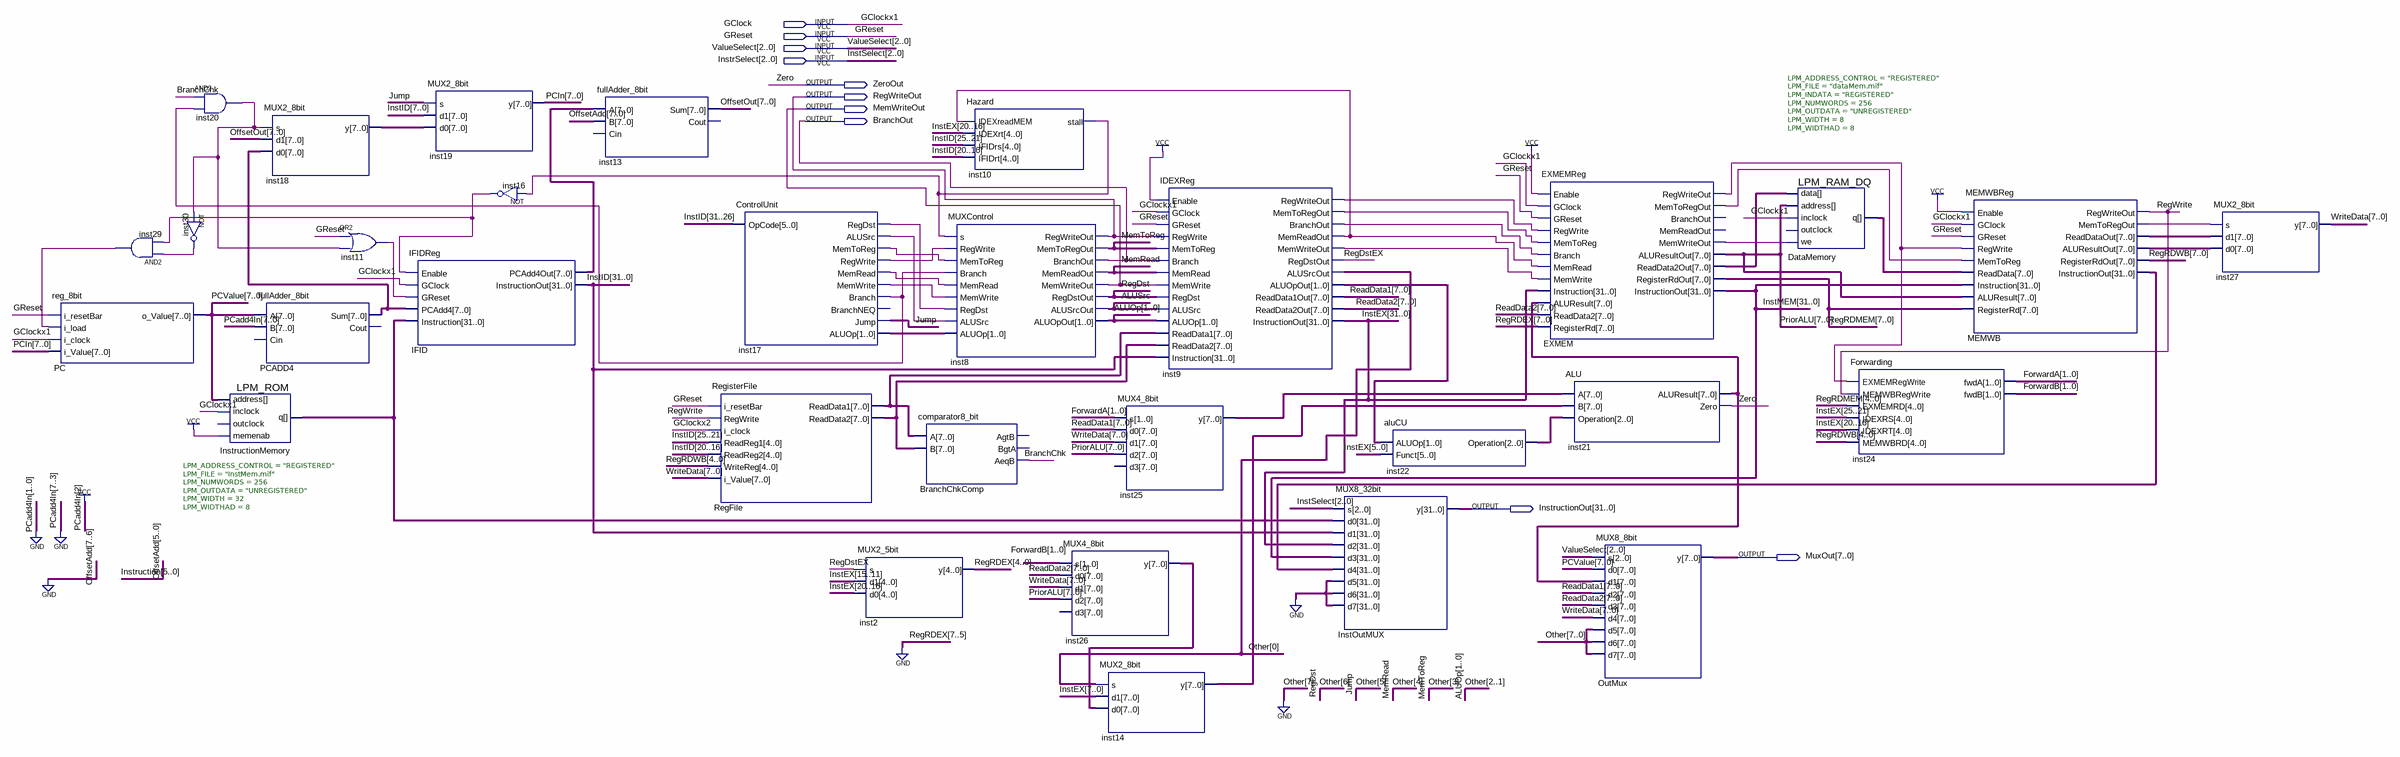
[diagram p0: schematic sheet]
// Quartus schematic pipelineProc.bdf as structural Verilog: 31 symbols, 10 pins
module pipelineProc (
  input  GClock,
  input  GReset,
  input  [2:0] ValueSelect,
  input  [2:0] InstrSelect,
  output ZeroOut,
  output RegWriteOut,
  output MemWriteOut,
  output BranchOut,
  output [31:0] InstructionOut,
  output [7:0] MuxOut
);

  wire ALUSrc, BranchChk, EXMEM_memtoregout, EXMEM_memwriteout, EXMEM_regwriteout, GClockx2, inst9_branchout,
       inst9_memreadout, inst9_memtoregout, inst9_memwriteout, inst9_regwriteout, inst10_stall, inst11_out,
       inst16_out, inst17_alusrc, inst17_branch, inst17_memread, inst17_memtoreg, inst17_memwrite,
       inst17_regdst, inst17_regwrite, inst20_out, inst29_out, inst30_out, Jump, MemRead, MemToReg,
       MEMWB_memtoregout, RegDst, RegDstEX, RegWrite;
  wire [1:0] ALUOp, ForwardA, ForwardB, inst9_aluopout, inst17_aluop;
  wire [2:0] inst22_operation;
  wire [4:0] RegRDEX;
  wire [5:0] OffsetAdd;
  wire [6:0] Other;
  wire [7:0] DataMemory_q, EXMEM_readdata2out, IFID_pcadd4out, inst14_y, inst18_y, inst21_aluresult,
       inst25_y, inst26_y, MEMWB_aluresultout, MEMWB_readdataout, OffsetOut, PCADD4_sum, PCIn, PCValue,
       PriorALU, ReadData1, ReadData2, RegFile_readdata1, RegFile_readdata2, RegRDMEM, RegRDWB, WriteData;
  wire [31:0] InstEX, InstID, InstMEM, InstructionMemory_q, MEMWB_instructionout;

  reg_8bit PC (.i_resetBar(GReset), .i_load(inst29_out), .i_clock(GClock), .i_Value(PCIn), .o_Value(PCValue));
  and inst29 (inst29_out, inst30_out, inst16_out);
  and inst20 (inst20_out, BranchChk, inst17_branch);
  not inst30 (inst30_out, inst20_out);
  LPM_ROM #(.LPM_ADDRESS_CONTROL("REGISTERED"), .LPM_FILE("InstMem.mif"), .LPM_NUMWORDS(256), .LPM_OUTDATA("UNREGISTERED"), .LPM_WIDTH(32), .LPM_WIDTHAD(8)) InstructionMemory (
    .address(PCValue), .inclock(GClock), .memenab(1'b1), .q(InstructionMemory_q));  // open: outclock
  MUX2_8bit inst18 (.s(inst20_out), .d1(OffsetOut), .d0(PCADD4_sum), .y(inst18_y));
  fullAdder_8bit PCADD4 (.A(PCValue), .B(8'b00000100), .Sum(PCADD4_sum));  // open: Cin, Cout
  or inst11 (inst11_out, GReset, inst20_out);
  MUX2_8bit inst19 (.s(Jump), .d1(InstID[7:0]), .d0(inst18_y), .y(PCIn));
  IFIDReg IFID (
    .Enable(inst16_out), .GClock(GClock), .GReset(inst11_out), .PCAdd4(PCADD4_sum),
    .Instruction(InstructionMemory_q), .PCAdd4Out(IFID_pcadd4out), .InstructionOut(InstID));
  not inst16 (inst16_out, inst10_stall);
  fullAdder_8bit inst13 (.A(IFID_pcadd4out), .B({2'b00, OffsetAdd}), .Sum(OffsetOut));  // open: Cin, Cout
  ControlUnit inst17 (
    .OpCode(InstID[31:26]), .RegDst(inst17_regdst), .ALUSrc(inst17_alusrc), .MemToReg(inst17_memtoreg),
    .RegWrite(inst17_regwrite), .MemRead(inst17_memread), .MemWrite(inst17_memwrite), .Branch(inst17_branch),
    .Jump(Jump), .ALUOp(inst17_aluop));  // open: BranchNEQ
  RegisterFile RegFile (
    .i_resetBar(GReset), .RegWrite(RegWrite), .i_clock(GClockx2), .ReadReg1(InstID[25:21]),
    .ReadReg2(InstID[20:16]), .WriteReg(RegRDWB[4:0]), .i_Value(WriteData), .ReadData1(RegFile_readdata1),
    .ReadData2(RegFile_readdata2));
  MUX2_5bit inst2 (.s(RegDstEX), .d1(InstEX[15:11]), .d0(InstEX[20:16]), .y(RegRDEX));
  comparator8_bit BranchChkComp (.A(RegFile_readdata1), .B(RegFile_readdata2), .AeqB(BranchChk));  // open: AgtB, BgtA
  Hazard inst10 (
    .IDEXreadMEM(inst9_memreadout), .IDEXrt(InstEX[20:16]), .IFIDrs(InstID[25:21]), .IFIDrt(InstID[20:16]),
    .stall(inst10_stall));
  MUXControl inst8 (
    .s(inst10_stall), .RegWrite(inst17_regwrite), .MemToReg(inst17_memtoreg), .Branch(inst17_branch),
    .MemRead(inst17_memread), .MemWrite(inst17_memwrite), .RegDst(inst17_regdst), .ALUSrc(inst17_alusrc),
    .ALUOp(inst17_aluop), .RegWriteOut(RegWriteOut), .MemToRegOut(MemToReg), .BranchOut(BranchOut),
    .MemReadOut(MemRead), .MemWriteOut(MemWriteOut), .RegDstOut(RegDst), .ALUSrcOut(ALUSrc), .ALUOpOut(ALUOp));
  MUX4_8bit inst26 (.s(ForwardB), .d0(ReadData2), .d1(WriteData), .d2(PriorALU), .y(inst26_y));  // open: d3
  MUX4_8bit inst25 (.s(ForwardA), .d0(ReadData1), .d1(WriteData), .d2(PriorALU), .y(inst25_y));  // open: d3
  MUX2_8bit inst14 (.s(Other[0]), .d1(InstEX[7:0]), .d0(inst26_y), .y(inst14_y));
  IDEXReg inst9 (
    .Enable(1'b1), .GClock(GClock), .GReset(GReset), .RegWrite(RegWriteOut), .MemToReg(MemToReg),
    .Branch(BranchOut), .MemRead(MemRead), .MemWrite(MemWriteOut), .RegDst(RegDst), .ALUSrc(ALUSrc),
    .ALUOp(ALUOp), .ReadData1(RegFile_readdata1), .ReadData2(RegFile_readdata2), .Instruction(InstID),
    .RegWriteOut(inst9_regwriteout), .MemToRegOut(inst9_memtoregout), .BranchOut(inst9_branchout),
    .MemReadOut(inst9_memreadout), .MemWriteOut(inst9_memwriteout), .RegDstOut(RegDstEX),
    .ALUSrcOut(Other[0]), .ALUOpOut(inst9_aluopout), .ReadData1Out(ReadData1), .ReadData2Out(ReadData2),
    .InstructionOut(InstEX));
  MUX8_32bit InstOutMUX (
    .s(InstrSelect), .d0(InstructionMemory_q), .d1(InstID), .d2(InstEX), .d3(InstMEM),
    .d4(MEMWB_instructionout), .d5({32{1'b0}}), .d6({32{1'b0}}), .d7({32{1'b0}}), .y(InstructionOut));
  aluCU inst22 (.ALUOp(inst9_aluopout), .Funct(InstEX[5:0]), .Operation(inst22_operation));
  EXMEMReg EXMEM (
    .Enable(1'b1), .GClock(GClock), .GReset(GReset), .RegWrite(inst9_regwriteout),
    .MemToReg(inst9_memtoregout), .Branch(inst9_branchout), .MemRead(inst9_memreadout),
    .MemWrite(inst9_memwriteout), .Instruction(InstEX), .ALUResult(inst21_aluresult), .ReadData2(ReadData2),
    .RegisterRd({3'b000, RegRDEX}), .RegWriteOut(EXMEM_regwriteout), .MemToRegOut(EXMEM_memtoregout),
    .MemWriteOut(EXMEM_memwriteout), .ALUResultOut(PriorALU), .ReadData2Out(EXMEM_readdata2out),
    .RegisterRdOut(RegRDMEM), .InstructionOut(InstMEM));  // open: BranchOut, MemReadOut
  ALU inst21 (.A(inst25_y), .B(inst14_y), .Operation(inst22_operation), .ALUResult(inst21_aluresult), .Zero(ZeroOut));
  MUX8_8bit OutMux (
    .s(ValueSelect), .d0(PCValue), .d1(inst21_aluresult), .d2(ReadData1), .d3(ReadData2), .d4(WriteData),
    .d5({1'b0, Other}), .d6({1'b0, Other}), .d7({1'b0, Other}), .y(MuxOut));
  LPM_RAM_DQ #(.LPM_ADDRESS_CONTROL("REGISTERED"), .LPM_FILE("dataMem.mif"), .LPM_INDATA("REGISTERED"), .LPM_NUMWORDS(256), .LPM_OUTDATA("UNREGISTERED"), .LPM_WIDTH(8), .LPM_WIDTHAD(8)) DataMemory (
    .inclock(GClock), .data(EXMEM_readdata2out), .address(PriorALU), .we(EXMEM_memwriteout), .q(DataMemory_q));  // open: outclock
  Forwarding inst24 (
    .EXMEMRegWrite(EXMEM_regwriteout), .MEMWBRegWrite(RegWrite), .EXMEMRD(RegRDMEM[4:0]),
    .IDEXRS(InstEX[25:21]), .IDEXRT(InstEX[20:16]), .MEMWBRD(RegRDWB[4:0]), .fwdA(ForwardA), .fwdB(ForwardB));
  MEMWBReg MEMWB (
    .Enable(1'b1), .GClock(GClock), .GReset(GReset), .RegWrite(EXMEM_regwriteout),
    .MemToReg(EXMEM_memtoregout), .ReadData(DataMemory_q), .Instruction(InstMEM), .ALUResult(PriorALU),
    .RegisterRd(RegRDMEM), .RegWriteOut(RegWrite), .MemToRegOut(MEMWB_memtoregout),
    .ReadDataOut(MEMWB_readdataout), .ALUResultOut(MEMWB_aluresultout), .RegisterRdOut(RegRDWB),
    .InstructionOut(MEMWB_instructionout));
  MUX2_8bit inst27 (.s(MEMWB_memtoregout), .d1(MEMWB_readdataout), .d0(MEMWB_aluresultout), .y(WriteData));

  // Other names for the same wires on the sheet: GClockx1 = GClock; InstSelect[2:0] = InstrSelect; Zero = ZeroOut
endmodule
